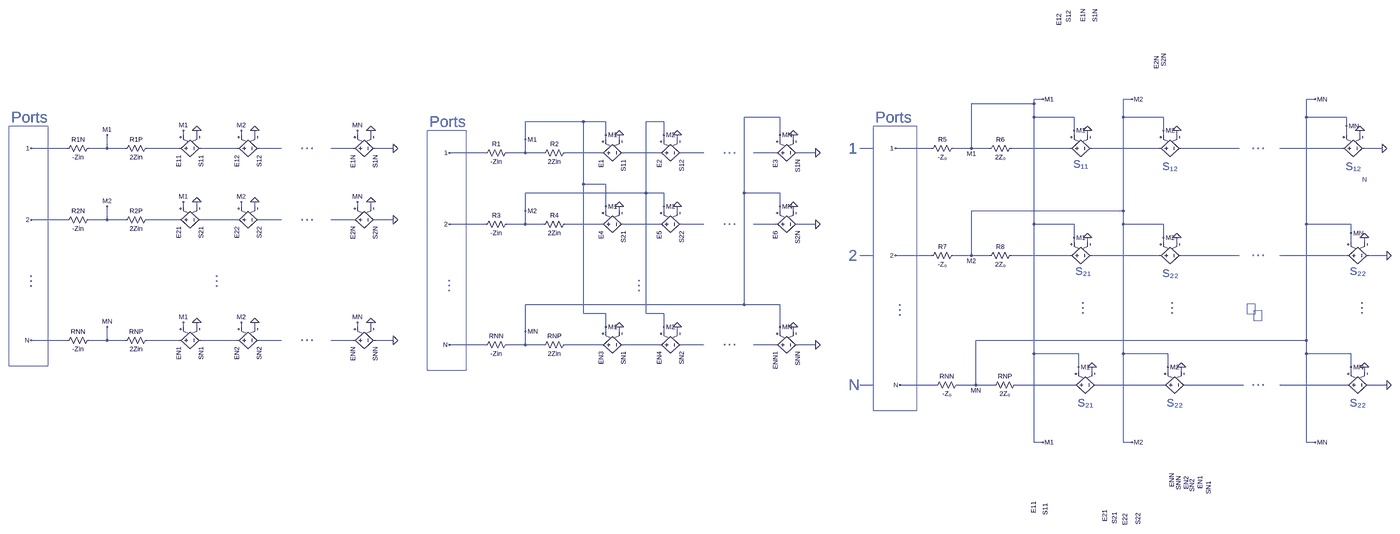
[diagram p0: schematic nport.asc, whole sheet]
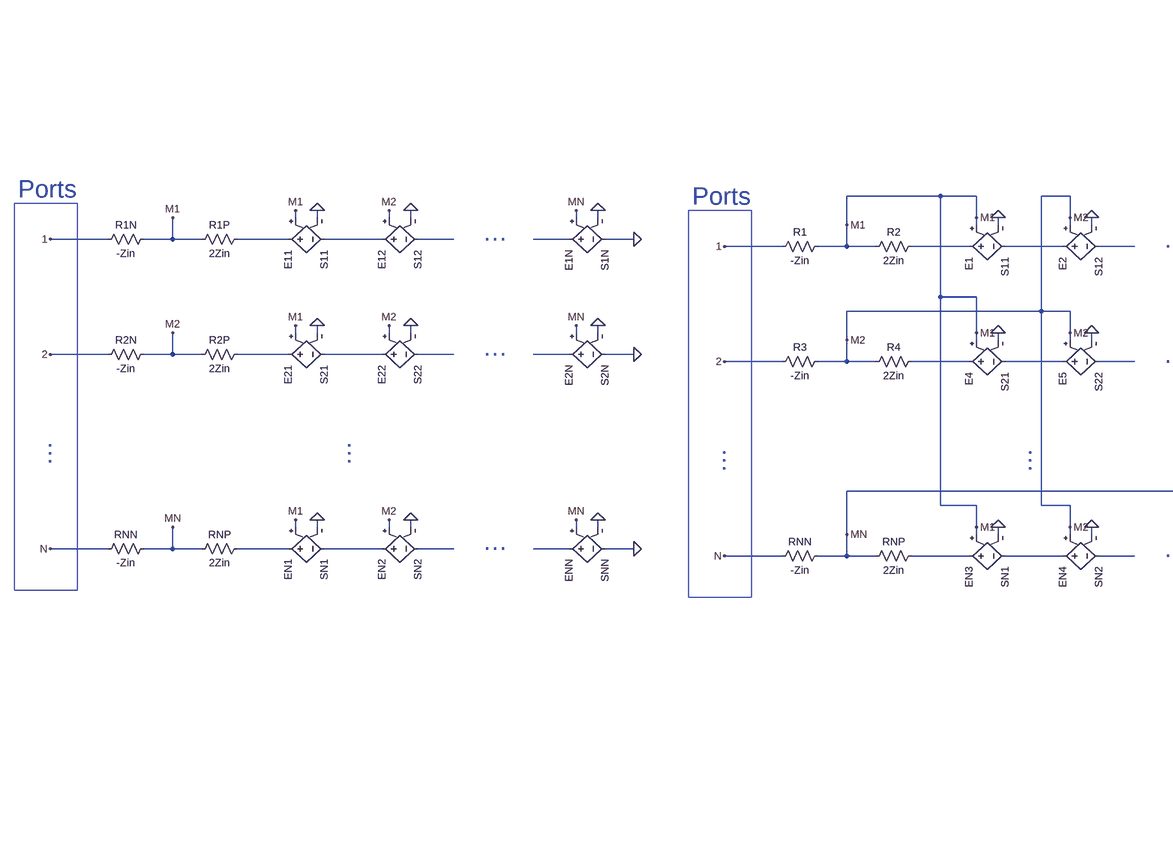
[diagram p1: schematic nport.asc, part, row 1 of 1, column 1 of 2]
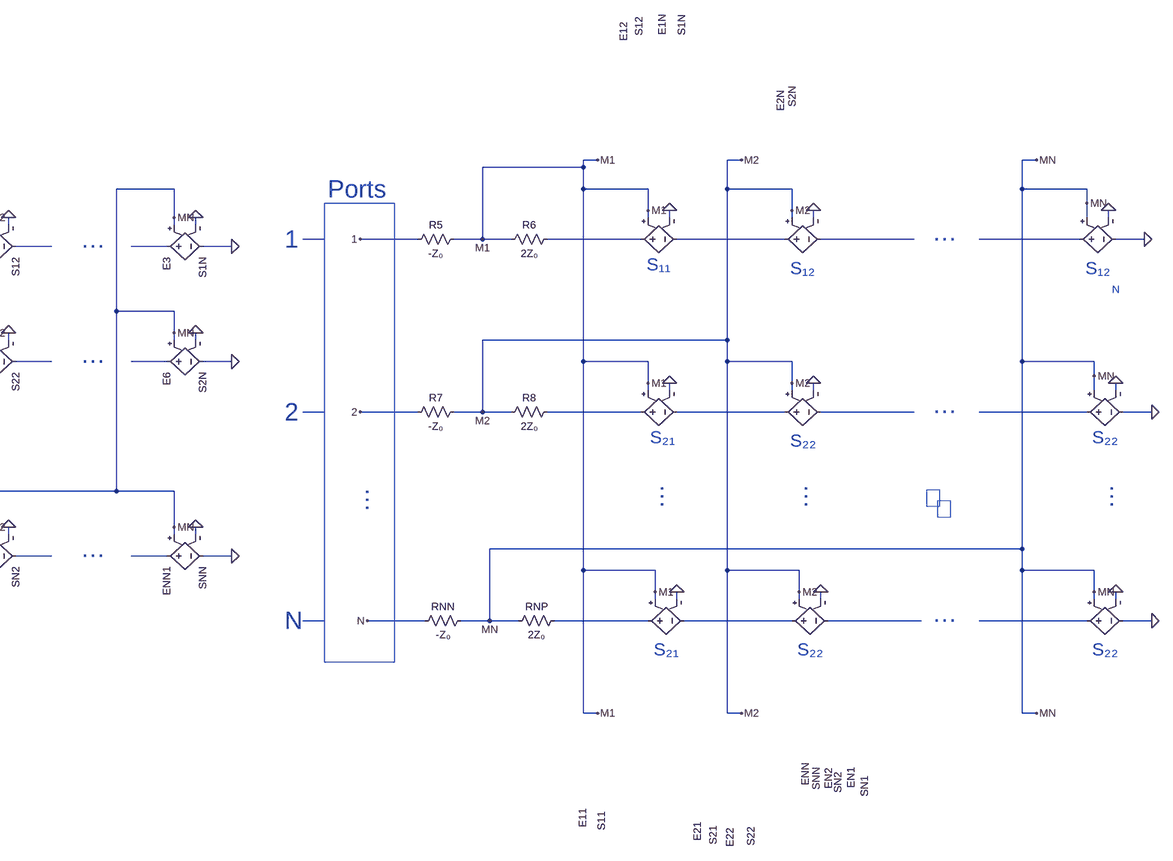
[diagram p2: schematic nport.asc, part, row 1 of 1, column 2 of 2]
nport.asc, the LTspice schematic file:
Version 4
SHEET 1 6752 1568
WIRE 5504 -192 5472 -192
WIRE 5824 -192 5792 -192
WIRE 6480 -192 6448 -192
WIRE 5472 -176 5472 -192
WIRE 5472 -176 5248 -176
WIRE 4352 -128 4224 -128
WIRE 5472 -128 5472 -176
WIRE 5616 -128 5472 -128
WIRE 5792 -128 5792 -192
WIRE 5936 -128 5792 -128
WIRE 6448 -128 6448 -192
WIRE 6592 -128 6448 -128
WIRE 3648 -112 3440 -112
WIRE 3728 -112 3648 -112
WIRE 3936 -112 3872 -112
WIRE 6592 -96 6592 -128
WIRE 5616 -80 5616 -128
WIRE 5936 -80 5936 -128
WIRE 1808 -64 1808 -80
WIRE 1856 -64 1856 -80
WIRE 2016 -64 2016 -80
WIRE 2064 -64 2064 -80
WIRE 2432 -64 2432 -80
WIRE 2480 -64 2480 -80
WIRE 3728 -64 3728 -112
WIRE 3936 -64 3936 -112
WIRE 4352 -64 4352 -128
WIRE 5616 -64 5616 -80
WIRE 5664 -64 5664 -80
WIRE 5936 -64 5936 -80
WIRE 5984 -64 5984 -80
WIRE 6592 -64 6592 -96
WIRE 6640 -64 6640 -80
WIRE 3440 -48 3440 -112
WIRE 3728 -48 3728 -64
WIRE 3776 -48 3776 -64
WIRE 3936 -48 3936 -64
WIRE 3984 -48 3984 -64
WIRE 4352 -48 4352 -64
WIRE 4400 -48 4400 -64
WIRE 1376 -16 1248 -16
WIRE 1520 -16 1520 -64
WIRE 1520 -16 1456 -16
WIRE 1584 -16 1520 -16
WIRE 1792 -16 1664 -16
WIRE 2000 -16 1872 -16
WIRE 2160 -16 2080 -16
WIRE 2416 -16 2336 -16
WIRE 2560 -16 2496 -16
WIRE 4896 -16 4848 -16
WIRE 5104 -16 4976 -16
WIRE 5248 -16 5248 -176
WIRE 5248 -16 5184 -16
WIRE 5312 -16 5248 -16
WIRE 5600 -16 5392 -16
WIRE 5920 -16 5680 -16
WIRE 6208 -16 6000 -16
WIRE 6576 -16 6352 -16
WIRE 6720 -16 6656 -16
WIRE 3296 0 3168 0
WIRE 3440 0 3440 -48
WIRE 3440 0 3376 0
WIRE 3504 0 3440 0
WIRE 3712 0 3584 0
WIRE 3920 0 3792 0
WIRE 4080 0 4000 0
WIRE 4336 0 4256 0
WIRE 4480 0 4416 0
WIRE 3648 112 3648 -112
WIRE 3728 112 3648 112
WIRE 3872 144 3872 -112
WIRE 3872 144 3440 144
WIRE 3936 144 3872 144
WIRE 4224 144 4224 -128
WIRE 4352 144 4224 144
WIRE 1808 192 1808 176
WIRE 1856 192 1856 176
WIRE 2016 192 2016 176
WIRE 2064 192 2064 176
WIRE 2432 192 2432 176
WIRE 2480 192 2480 176
WIRE 3728 192 3728 112
WIRE 3936 192 3936 144
WIRE 4352 192 4352 144
WIRE 3440 208 3440 144
WIRE 3728 208 3728 192
WIRE 3776 208 3776 192
WIRE 3936 208 3936 192
WIRE 3984 208 3984 192
WIRE 4352 208 4352 192
WIRE 4400 208 4400 192
WIRE 5792 208 5792 -128
WIRE 5792 208 5248 208
WIRE 1376 240 1248 240
WIRE 1520 240 1520 192
WIRE 1520 240 1456 240
WIRE 1584 240 1520 240
WIRE 1792 240 1664 240
WIRE 2000 240 1872 240
WIRE 2160 240 2080 240
WIRE 2416 240 2336 240
WIRE 2560 240 2496 240
WIRE 3296 256 3168 256
WIRE 3440 256 3440 208
WIRE 3440 256 3376 256
WIRE 3504 256 3440 256
WIRE 3712 256 3584 256
WIRE 3920 256 3792 256
WIRE 4080 256 4000 256
WIRE 4336 256 4256 256
WIRE 4480 256 4416 256
WIRE 5472 256 5472 -128
WIRE 5616 256 5472 256
WIRE 5792 256 5792 208
WIRE 5936 256 5792 256
WIRE 6448 256 6448 -128
WIRE 6608 256 6448 256
WIRE 6608 288 6608 256
WIRE 5616 304 5616 256
WIRE 5936 304 5936 256
WIRE 5616 320 5616 304
WIRE 5664 320 5664 304
WIRE 5936 320 5936 304
WIRE 5984 320 5984 304
WIRE 6608 320 6608 288
WIRE 6656 320 6656 304
WIRE 4896 368 4848 368
WIRE 5104 368 4976 368
WIRE 5248 368 5248 208
WIRE 5248 368 5184 368
WIRE 5312 368 5248 368
WIRE 5600 368 5392 368
WIRE 5920 368 5680 368
WIRE 6208 368 6000 368
WIRE 6592 368 6352 368
WIRE 6736 368 6672 368
WIRE 4224 544 4224 144
WIRE 4224 544 3440 544
WIRE 4352 544 4224 544
WIRE 3648 576 3648 112
WIRE 3728 576 3648 576
WIRE 3872 576 3872 144
WIRE 3936 576 3872 576
WIRE 1808 624 1808 608
WIRE 1856 624 1856 608
WIRE 2016 624 2016 608
WIRE 2064 624 2064 608
WIRE 2432 624 2432 608
WIRE 2480 624 2480 608
WIRE 3728 624 3728 576
WIRE 3936 624 3936 576
WIRE 4352 624 4352 544
WIRE 3440 640 3440 544
WIRE 3728 640 3728 624
WIRE 3776 640 3776 624
WIRE 3936 640 3936 624
WIRE 3984 640 3984 624
WIRE 4352 640 4352 624
WIRE 4400 640 4400 624
WIRE 1376 672 1248 672
WIRE 1520 672 1520 624
WIRE 1520 672 1456 672
WIRE 1584 672 1520 672
WIRE 1792 672 1664 672
WIRE 2000 672 1872 672
WIRE 2160 672 2080 672
WIRE 2416 672 2336 672
WIRE 2560 672 2496 672
WIRE 6448 672 6448 256
WIRE 6448 672 5264 672
WIRE 3296 688 3168 688
WIRE 3440 688 3440 640
WIRE 3440 688 3376 688
WIRE 3504 688 3440 688
WIRE 3712 688 3584 688
WIRE 3920 688 3792 688
WIRE 4080 688 4000 688
WIRE 4336 688 4256 688
WIRE 4480 688 4416 688
WIRE 5472 720 5472 256
WIRE 5632 720 5472 720
WIRE 5792 720 5792 256
WIRE 5952 720 5792 720
WIRE 6448 720 6448 672
WIRE 6608 720 6448 720
WIRE 5632 768 5632 720
WIRE 5952 768 5952 720
WIRE 6608 768 6608 720
WIRE 5632 784 5632 768
WIRE 5680 784 5680 768
WIRE 5952 784 5952 768
WIRE 6000 784 6000 768
WIRE 6608 784 6608 768
WIRE 6656 784 6656 768
WIRE 4896 832 4848 832
WIRE 5120 832 4992 832
WIRE 5264 832 5264 672
WIRE 5264 832 5200 832
WIRE 5328 832 5264 832
WIRE 5616 832 5408 832
WIRE 5936 832 5696 832
WIRE 6224 832 6016 832
WIRE 6592 832 6352 832
WIRE 6736 832 6672 832
WIRE 5472 1056 5472 720
WIRE 5504 1056 5472 1056
WIRE 5792 1056 5792 720
WIRE 5824 1056 5792 1056
WIRE 6448 1056 6448 720
WIRE 6480 1056 6448 1056
FLAG 1248 -16 1
FLAG 1520 -64 M1
FLAG 1808 -80 M1
FLAG 1856 -80 0
FLAG 2016 -80 M2
FLAG 2064 -80 0
FLAG 2432 -80 MN
FLAG 2480 -80 0
FLAG 2560 -16 0
FLAG 1248 240 2
FLAG 1520 192 M2
FLAG 1808 176 M1
FLAG 1856 176 0
FLAG 2016 176 M2
FLAG 2064 176 0
FLAG 2432 176 MN
FLAG 2480 176 0
FLAG 2560 240 0
FLAG 1248 672 N
FLAG 1520 624 MN
FLAG 1808 608 M1
FLAG 1856 608 0
FLAG 2016 608 M2
FLAG 2064 608 0
FLAG 2432 608 MN
FLAG 2480 608 0
FLAG 2560 672 0
FLAG 3168 0 1
FLAG 3440 -48 M1
FLAG 3728 -64 M1
FLAG 3776 -64 0
FLAG 3936 -64 M2
FLAG 3984 -64 0
FLAG 4352 -64 MN
FLAG 4400 -64 0
FLAG 4480 0 0
FLAG 3168 256 2
FLAG 3440 208 M2
FLAG 3728 192 M1
FLAG 3776 192 0
FLAG 3936 192 M2
FLAG 3984 192 0
FLAG 4352 192 MN
FLAG 4400 192 0
FLAG 4480 256 0
FLAG 3168 688 N
FLAG 3440 640 MN
FLAG 3728 624 M1
FLAG 3776 624 0
FLAG 3936 624 M2
FLAG 3984 624 0
FLAG 4352 624 MN
FLAG 4400 624 0
FLAG 4480 688 0
FLAG 4976 -16 1
FLAG 5504 -192 M1
FLAG 5616 -80 M1
FLAG 5664 -80 0
FLAG 5936 -80 M2
FLAG 5984 -80 0
FLAG 6640 -80 0
FLAG 6720 -16 0
FLAG 4976 368 2
FLAG 5824 -192 M2
FLAG 5984 304 0
FLAG 6656 304 0
FLAG 6736 368 0
FLAG 4992 832 N
FLAG 5264 832 MN
FLAG 5632 768 M1
FLAG 5680 768 0
FLAG 5952 768 M2
FLAG 6000 768 0
FLAG 6656 768 0
FLAG 6736 832 0
FLAG 5248 -16 M1
FLAG 5248 368 M2
FLAG 5616 304 M1
FLAG 5664 304 0
FLAG 5936 304 M2
FLAG 5504 1056 M1
FLAG 5824 1056 M2
FLAG 6592 -96 MN
FLAG 6608 768 MN
FLAG 6480 -192 MN
FLAG 6480 1056 MN
FLAG 6608 288 MN
SYMBOL Res 1472 -32 R90
WINDOW 0 0 56 VBottom 2
WINDOW 3 32 56 VTop 2
SYMATTR InstName R1N
SYMATTR Value -Zin
SYMBOL Res 1680 -32 R90
WINDOW 0 0 56 VBottom 2
WINDOW 3 32 56 VTop 2
SYMATTR InstName R1P
SYMATTR Value 2Zin
SYMBOL e 1776 -16 M90
SYMATTR InstName E11
SYMATTR Value S11
SYMBOL e 1984 -16 M90
SYMATTR InstName E12
SYMATTR Value S12
SYMBOL e 2400 -16 M90
SYMATTR InstName E1N
SYMATTR Value S1N
SYMBOL Res 1472 224 R90
WINDOW 0 0 56 VBottom 2
WINDOW 3 32 56 VTop 2
SYMATTR InstName R2N
SYMATTR Value -Zin
SYMBOL Res 1680 224 R90
WINDOW 0 0 56 VBottom 2
WINDOW 3 32 56 VTop 2
SYMATTR InstName R2P
SYMATTR Value 2Zin
SYMBOL e 1776 240 M90
SYMATTR InstName E21
SYMATTR Value S21
SYMBOL e 1984 240 M90
SYMATTR InstName E22
SYMATTR Value S22
SYMBOL e 2400 240 M90
SYMATTR InstName E2N
SYMATTR Value S2N
SYMBOL Res 1472 656 R90
WINDOW 0 0 56 VBottom 2
WINDOW 3 32 56 VTop 2
SYMATTR InstName RNN
SYMATTR Value -Zin
SYMBOL Res 1680 656 R90
WINDOW 0 0 56 VBottom 2
WINDOW 3 32 56 VTop 2
SYMATTR InstName RNP
SYMATTR Value 2Zin
SYMBOL e 1776 672 M90
SYMATTR InstName EN1
SYMATTR Value SN1
SYMBOL e 1984 672 M90
SYMATTR InstName EN2
SYMATTR Value SN2
SYMBOL e 2400 672 M90
SYMATTR InstName ENN
SYMATTR Value SNN
SYMBOL Res 3392 -16 R90
WINDOW 0 0 56 VBottom 2
WINDOW 3 32 56 VTop 2
SYMATTR InstName R1
SYMATTR Value -Zin
SYMBOL Res 3600 -16 R90
WINDOW 0 0 56 VBottom 2
WINDOW 3 32 56 VTop 2
SYMATTR InstName R2
SYMATTR Value 2Zin
SYMBOL e 3696 0 M90
SYMATTR InstName E1
SYMATTR Value S11
SYMBOL e 3904 0 M90
SYMATTR InstName E2
SYMATTR Value S12
SYMBOL e 4320 0 M90
SYMATTR InstName E3
SYMATTR Value S1N
SYMBOL Res 3392 240 R90
WINDOW 0 0 56 VBottom 2
WINDOW 3 32 56 VTop 2
SYMATTR InstName R3
SYMATTR Value -Zin
SYMBOL Res 3600 240 R90
WINDOW 0 0 56 VBottom 2
WINDOW 3 32 56 VTop 2
SYMATTR InstName R4
SYMATTR Value 2Zin
SYMBOL e 3696 256 M90
SYMATTR InstName E4
SYMATTR Value S21
SYMBOL e 3904 256 M90
SYMATTR InstName E5
SYMATTR Value S22
SYMBOL e 4320 256 M90
SYMATTR InstName E6
SYMATTR Value S2N
SYMBOL Res 3392 672 R90
WINDOW 0 0 56 VBottom 2
WINDOW 3 32 56 VTop 2
SYMATTR InstName RNN
SYMATTR Value -Zin
SYMBOL Res 3600 672 R90
WINDOW 0 0 56 VBottom 2
WINDOW 3 32 56 VTop 2
SYMATTR InstName RNP
SYMATTR Value 2Zin
SYMBOL e 3696 688 M90
SYMATTR InstName EN3
SYMATTR Value SN1
SYMBOL e 3904 688 M90
SYMATTR InstName EN4
SYMATTR Value SN2
SYMBOL e 4320 688 M90
SYMATTR InstName ENN1
SYMATTR Value SNN
SYMBOL Res 5200 -32 R90
WINDOW 0 0 56 VBottom 2
WINDOW 3 32 56 VTop 2
SYMATTR InstName R5
SYMATTR Value -Z₀
SYMBOL Res 5408 -32 R90
WINDOW 0 0 56 VBottom 2
WINDOW 3 32 56 VTop 2
SYMATTR InstName R6
SYMATTR Value 2Z₀
SYMBOL e 5584 -16 M90
WINDOW 0 1465 -113 Left 2
WINDOW 3 1472 -71 Left 2
SYMATTR InstName E11
SYMATTR Value S11
SYMBOL e 5904 -16 M90
WINDOW 0 -1493 -342 Left 2
WINDOW 3 -1505 -308 Left 2
SYMATTR InstName E12
SYMATTR Value S12
SYMBOL e 6560 -16 M90
WINDOW 0 -1510 -912 Left 2
WINDOW 3 -1509 -869 Left 2
SYMATTR InstName E1N
SYMATTR Value S1N
SYMBOL Res 5200 352 R90
WINDOW 0 0 56 VBottom 2
WINDOW 3 32 56 VTop 2
SYMATTR InstName R7
SYMATTR Value -Z₀
SYMBOL Res 5408 352 R90
WINDOW 0 0 56 VBottom 2
WINDOW 3 32 56 VTop 2
SYMATTR InstName R8
SYMATTR Value 2Z₀
SYMBOL e 5904 368 M90
WINDOW 0 1124 -105 Left 2
WINDOW 3 1122 -59 Left 2
SYMATTR InstName E22
SYMATTR Value S22
SYMBOL e 6576 368 M90
WINDOW 0 -1160 -665 Left 2
WINDOW 3 -1169 -639 Left 2
SYMATTR InstName E2N
SYMATTR Value S2N
SYMBOL Res 5216 816 R90
WINDOW 0 0 56 VBottom 2
WINDOW 3 32 56 VTop 2
SYMATTR InstName RNN
SYMATTR Value -Z₀
SYMBOL Res 5424 816 R90
WINDOW 0 0 56 VBottom 2
WINDOW 3 32 56 VTop 2
SYMATTR InstName RNP
SYMATTR Value 2Z₀
SYMBOL e 5600 832 M90
WINDOW 0 526 468 Left 2
WINDOW 3 545 498 Left 2
SYMATTR InstName EN1
SYMATTR Value SN1
SYMBOL e 5920 832 M90
WINDOW 0 528 98 Left 2
WINDOW 3 537 119 Left 2
SYMATTR InstName EN2
SYMATTR Value SN2
SYMBOL e 6576 832 M90
WINDOW 0 516 -610 Left 2
WINDOW 3 526 -586 Left 2
SYMATTR InstName ENN
SYMATTR Value SNN
SYMBOL e 5584 368 M90
WINDOW 0 1111 142 Left 2
WINDOW 3 1119 177 Left 2
SYMATTR InstName E21
SYMATTR Value S21
TEXT 2224 -32 Left 5 ;…
TEXT 2224 224 Left 5 ;…
TEXT 1912 432 VRight 5 ;…
TEXT 2224 656 Left 5 ;…
TEXT 1232 432 VRight 5 ;…
TEXT 1176 -128 Left 5 ;Ports
TEXT 4144 -16 Left 5 ;…
TEXT 4144 240 Left 5 ;…
TEXT 3832 448 VRight 5 ;…
TEXT 4144 672 Left 5 ;…
TEXT 3152 448 VRight 5 ;…
TEXT 3096 -112 Left 5 ;Ports
TEXT 6248 352 Left 5 ;…
TEXT 5632 528 VRight 5 ;…
TEXT 4976 536 VRight 5 ;…
TEXT 4904 -128 Left 5 ;Ports
TEXT 6248 -32 Left 5 ;…
TEXT 6248 816 Left 5 ;…
TEXT 5952 528 VRight 5 ;…
TEXT 6632 528 VRight 5 ;…
TEXT 6272 560 Right 5 ;⠑
TEXT 6296 584 Right 5 ;⠑
TEXT 4808 -16 Left 5 ;1
TEXT 4808 368 Left 5 ;2
TEXT 4808 832 Left 5 ;N
TEXT 5640 40 Center 4 ;S₁₁
TEXT 5960 48 Center 4 ;S₁₂
TEXT 6616 48 Center 4 ;S₁₂
TEXT 5648 424 Center 4 ;S₂₁
TEXT 5960 432 Center 4 ;S₂₂
TEXT 6632 424 Center 4 ;S₂₂
TEXT 5656 896 Center 4 ;S₂₁
TEXT 5976 896 Center 4 ;S₂₂
TEXT 6632 896 Center 4 ;S₂₂
TEXT 6648 96 Left 2 ;N
RECTANGLE Normal 1168 -96 1308 764
RECTANGLE Normal 3088 -80 3228 780
RECTANGLE Normal 4896 -96 5052 924

The netlist it stands for:
* nport.asc
R1N M1 1 -Zin
R1P N001 M1 2Zin
E11 N001 N002 M1 0 S11
E12 N002 N003 M2 0 S12
E1N N004 0 MN 0 S1N
R2N M2 2 -Zin
R2P N014 M2 2Zin
E21 N014 N015 M1 0 S21
E22 N015 N016 M2 0 S22
E2N N017 0 MN 0 S2N
RNN MN N -Zin
RNP N027 MN 2Zin
EN1 N027 N028 M1 0 SN1
EN2 N028 N029 M2 0 SN2
ENN N030 0 MN 0 SNN
R1 M1 1 -Zin
R2 N010 M1 2Zin
E1 N010 N011 M1 0 S11
E2 N011 N012 M2 0 S12
E3 N013 0 MN 0 S1N
R3 M2 2 -Zin
R4 N018 M2 2Zin
E4 N018 N019 M1 0 S21
E5 N019 N020 M2 0 S22
E6 N021 0 MN 0 S2N
RNN MN N -Zin
RNP N031 MN 2Zin
EN3 N031 N032 M1 0 SN1
EN4 N032 N033 M2 0 SN2
ENN1 N034 0 MN 0 SNN
R5 M1 1 -Z₀
R6 N006 M1 2Z₀
E11 N006 N007 M1 0 S11
E12 N007 N008 M2 0 S12
E1N N009 0 MN 0 S1N
R7 M2 2 -Z₀
R8 N023 M2 2Z₀
E22 N024 N025 M2 0 S22
E2N N026 0 MN 0 S2N
RNN MN N -Z₀
RNP N036 MN 2Z₀
EN1 N036 N037 M1 0 SN1
EN2 N037 N038 M2 0 SN2
ENN N039 0 MN 0 SNN
E21 N023 N024 M1 0 S21
* …
* …
* …
* …
* …
* Ports
* …
* …
* …
* …
* …
* Ports
* …
* …
* …
* Ports
* …
* …
* …
* …
* ⠑
* ⠑
* 1
* 2
* N
* S₁₁
* S₁₂
* S₁₂
* S₂₁
* S₂₂
* S₂₂
* S₂₁
* S₂₂
* S₂₂
* N
.backanno
.end